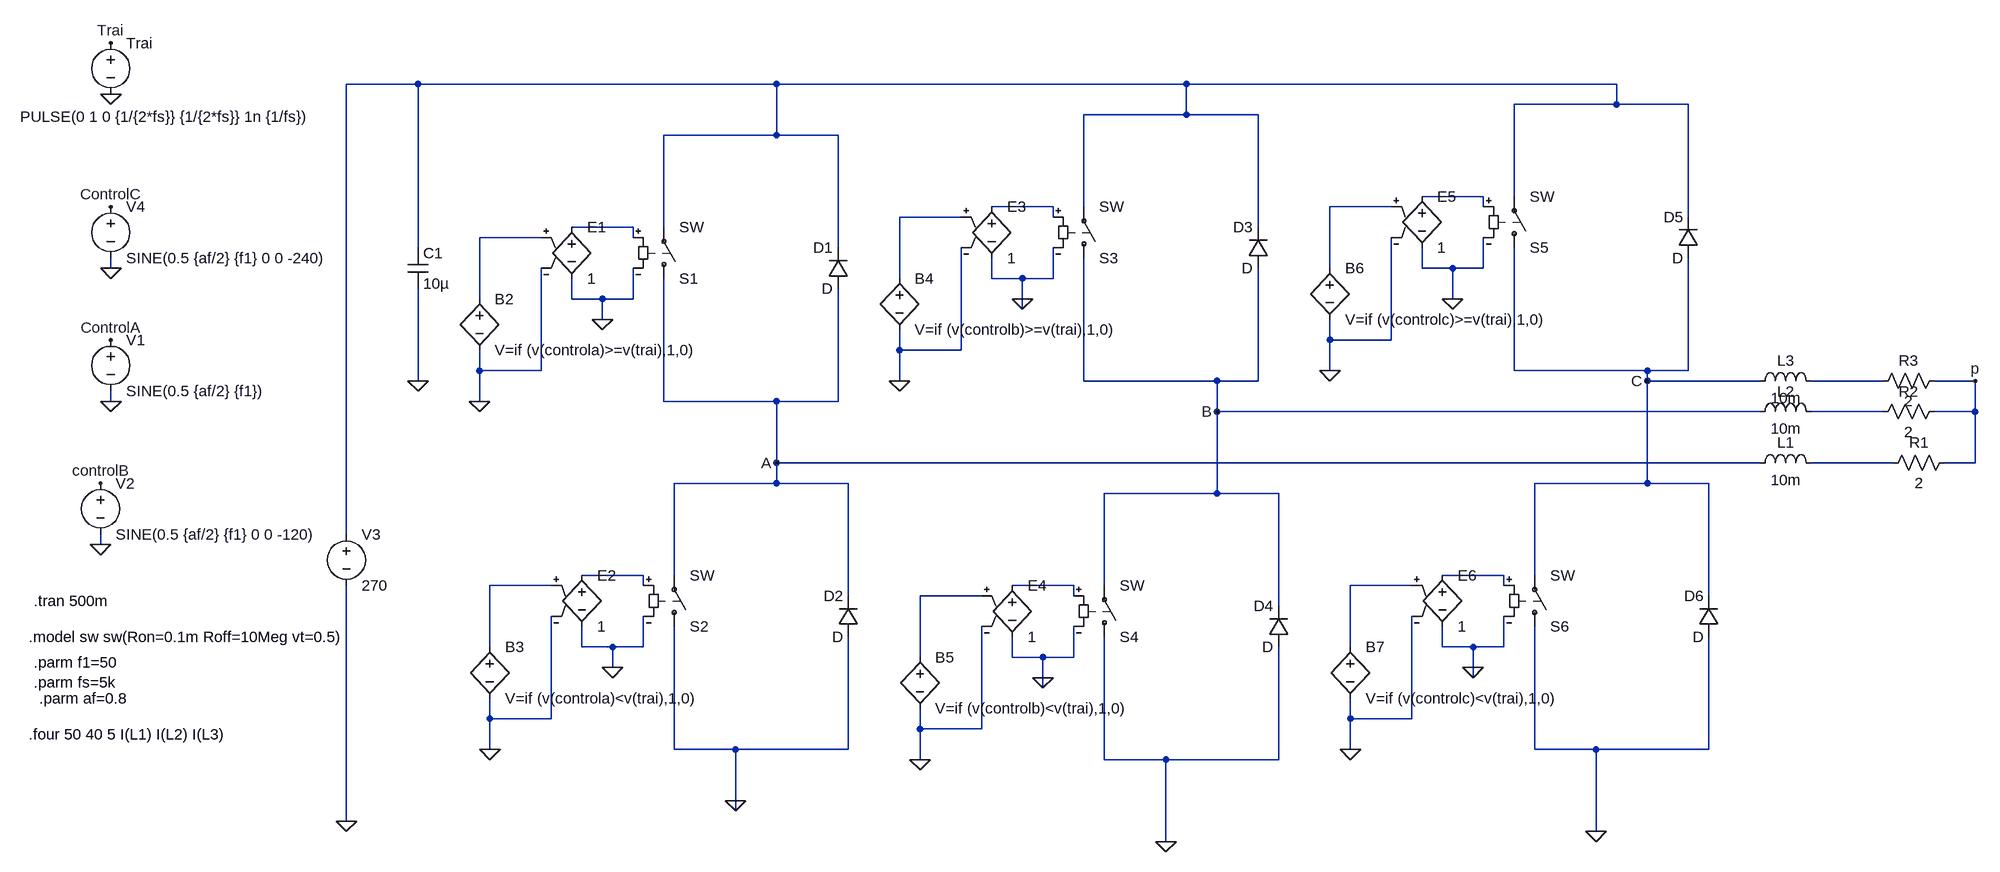
[diagram p0: schematic 3-PHASE INVERTER.asc]
3-PHASE INVERTER.asc, the LTspice schematic file:
Version 4
SHEET 1 4212 1888
WIRE 672 16 560 16
WIRE 1232 16 672 16
WIRE 1872 16 1232 16
WIRE 2544 16 1872 16
WIRE 2544 48 2544 16
WIRE 2544 48 2384 48
WIRE 2656 48 2544 48
WIRE 1872 64 1872 16
WIRE 1872 64 1712 64
WIRE 1984 64 1872 64
WIRE 1232 96 1232 16
WIRE 1232 96 1056 96
WIRE 1328 96 1232 96
WIRE 2336 192 2240 192
WIRE 2384 192 2384 48
WIRE 1664 208 1568 208
WIRE 1712 208 1712 64
WIRE 2192 208 2096 208
WIRE 2336 208 2336 192
WIRE 1520 224 1424 224
WIRE 1664 224 1664 208
WIRE 2656 224 2656 48
WIRE 1008 240 912 240
WIRE 1056 240 1056 96
WIRE 1984 240 1984 64
WIRE 864 256 768 256
WIRE 1008 256 1008 240
WIRE 672 272 672 16
WIRE 1328 272 1328 96
WIRE 192 304 192 288
WIRE 2096 304 2096 208
WIRE 2240 304 2240 272
WIRE 2288 304 2240 304
WIRE 2336 304 2336 256
WIRE 2336 304 2288 304
WIRE 1424 320 1424 224
WIRE 1568 320 1568 288
WIRE 1616 320 1568 320
WIRE 1664 320 1664 272
WIRE 1664 320 1616 320
WIRE 768 352 768 256
WIRE 912 352 912 320
WIRE 960 352 912 352
WIRE 1008 352 1008 304
WIRE 1008 352 960 352
WIRE 1616 352 1616 320
WIRE 2288 352 2288 304
WIRE 1616 368 1616 352
WIRE 960 384 960 352
WIRE 2096 416 2096 384
WIRE 2192 416 2192 256
WIRE 2192 416 2096 416
WIRE 1424 432 1424 400
WIRE 1520 432 1520 272
WIRE 1520 432 1424 432
WIRE 768 464 768 432
WIRE 864 464 864 304
WIRE 864 464 768 464
WIRE 2096 464 2096 416
WIRE 2384 464 2384 272
WIRE 2592 464 2384 464
WIRE 2656 464 2656 288
WIRE 2656 464 2592 464
WIRE 672 480 672 336
WIRE 1424 480 1424 432
WIRE 1712 480 1712 288
WIRE 1920 480 1712 480
WIRE 1984 480 1984 304
WIRE 1984 480 1920 480
WIRE 2592 480 2592 464
WIRE 2768 480 2592 480
WIRE 2960 480 2848 480
WIRE 3104 480 3040 480
WIRE 192 512 192 496
WIRE 768 512 768 464
WIRE 1056 512 1056 320
WIRE 1232 512 1056 512
WIRE 1328 512 1328 336
WIRE 1328 512 1232 512
WIRE 1920 528 1920 480
WIRE 2768 528 1920 528
WIRE 2960 528 2848 528
WIRE 3104 528 3104 480
WIRE 3104 528 3040 528
WIRE 1232 608 1232 512
WIRE 2768 608 1232 608
WIRE 2976 608 2848 608
WIRE 3104 608 3104 528
WIRE 3104 608 3056 608
WIRE 1232 640 1232 608
WIRE 1232 640 1072 640
WIRE 1344 640 1232 640
WIRE 2592 640 2592 480
WIRE 2592 640 2416 640
WIRE 2688 640 2592 640
WIRE 1920 656 1920 528
WIRE 1920 656 1744 656
WIRE 2016 656 1920 656
WIRE 560 720 560 16
WIRE 176 736 176 720
WIRE 1024 784 928 784
WIRE 1072 784 1072 640
WIRE 2368 784 2272 784
WIRE 2416 784 2416 640
WIRE 880 800 784 800
WIRE 1024 800 1024 784
WIRE 1696 800 1600 800
WIRE 1744 800 1744 656
WIRE 2224 800 2128 800
WIRE 2368 800 2368 784
WIRE 1344 816 1344 640
WIRE 1552 816 1456 816
WIRE 1696 816 1696 800
WIRE 2688 816 2688 640
WIRE 2016 832 2016 656
WIRE 784 896 784 800
WIRE 928 896 928 864
WIRE 976 896 928 896
WIRE 1024 896 1024 848
WIRE 1024 896 976 896
WIRE 2128 896 2128 800
WIRE 2272 896 2272 864
WIRE 2320 896 2272 896
WIRE 2368 896 2368 848
WIRE 2368 896 2320 896
WIRE 1456 912 1456 816
WIRE 1600 912 1600 880
WIRE 1648 912 1600 912
WIRE 1696 912 1696 864
WIRE 1696 912 1648 912
WIRE 976 928 976 896
WIRE 2320 928 2320 896
WIRE 1648 944 1648 912
WIRE 2320 944 2320 928
WIRE 1648 960 1648 944
WIRE 784 1008 784 976
WIRE 880 1008 880 848
WIRE 880 1008 784 1008
WIRE 2128 1008 2128 976
WIRE 2224 1008 2224 848
WIRE 2224 1008 2128 1008
WIRE 1456 1024 1456 992
WIRE 1552 1024 1552 864
WIRE 1552 1024 1456 1024
WIRE 784 1056 784 1008
WIRE 1072 1056 1072 864
WIRE 1168 1056 1072 1056
WIRE 1344 1056 1344 880
WIRE 1344 1056 1168 1056
WIRE 2128 1056 2128 1008
WIRE 2416 1056 2416 864
WIRE 2512 1056 2416 1056
WIRE 2688 1056 2688 880
WIRE 2688 1056 2512 1056
WIRE 1456 1072 1456 1024
WIRE 1744 1072 1744 880
WIRE 1840 1072 1744 1072
WIRE 2016 1072 2016 896
WIRE 2016 1072 1840 1072
WIRE 1168 1136 1168 1056
WIRE 1168 1152 1168 1136
WIRE 560 1168 560 800
WIRE 2512 1184 2512 1056
WIRE 1840 1200 1840 1072
FLAG 192 32 0
FLAG 192 -48 Trai
FLAG 192 512 0
FLAG 192 416 ControlA
FLAG 768 512 0
FLAG 784 1056 0
FLAG 1424 480 0
FLAG 1456 1072 0
FLAG 1168 1136 0
FLAG 1840 1200 0
FLAG 560 1168 0
FLAG 672 480 0
FLAG 2096 464 0
FLAG 2128 1056 0
FLAG 2512 1184 0
FLAG 176 736 0
FLAG 176 640 controlB
FLAG 192 304 0
FLAG 192 208 ControlC
FLAG 3104 480 p
FLAG 1232 608 A
FLAG 1920 528 B
FLAG 2592 480 C
FLAG 960 384 0
FLAG 1616 352 0
FLAG 2288 352 0
FLAG 2320 928 0
FLAG 1648 944 0
FLAG 976 928 0
SYMBOL voltage 192 -64 R0
WINDOW 3 306 131 Right 2
SYMATTR Value PULSE(0 1 0 {1/{2*fs}} {1/{2*fs}} 1n {1/fs})
SYMATTR InstName Trai
SYMBOL voltage 192 400 R0
SYMATTR InstName V1
SYMATTR Value SINE(0.5 {af/2} {f1})
SYMBOL bv 768 336 R0
SYMATTR InstName B2
SYMATTR Value V=if (v(controla)>=v(trai),1,0)
SYMBOL e 912 224 R0
SYMATTR InstName E1
SYMATTR Value 1
SYMBOL sw 1056 336 M180
SYMATTR InstName S1
SYMBOL diode 1344 336 R180
WINDOW 0 24 64 Left 2
WINDOW 3 24 0 Left 2
SYMATTR InstName D1
SYMBOL bv 784 880 R0
SYMATTR InstName B3
SYMATTR Value V=if (v(controla)<v(trai),1,0)
SYMBOL e 928 768 R0
SYMATTR InstName E2
SYMATTR Value 1
SYMBOL sw 1072 880 M180
SYMATTR InstName S2
SYMBOL diode 1360 880 R180
WINDOW 0 24 64 Left 2
WINDOW 3 24 0 Left 2
SYMATTR InstName D2
SYMBOL bv 1424 304 R0
SYMATTR InstName B4
SYMATTR Value V=if (v(controlb)>=v(trai),1,0)
SYMBOL e 1568 192 R0
SYMATTR InstName E3
SYMATTR Value 1
SYMBOL sw 1712 304 M180
SYMATTR InstName S3
SYMBOL diode 2000 304 R180
WINDOW 0 24 64 Left 2
WINDOW 3 24 0 Left 2
SYMATTR InstName D3
SYMBOL bv 1456 896 R0
SYMATTR InstName B5
SYMATTR Value V=if (v(controlb)<v(trai),1,0)
SYMBOL e 1600 784 R0
SYMATTR InstName E4
SYMATTR Value 1
SYMBOL sw 1744 896 M180
SYMATTR InstName S4
SYMBOL diode 2032 896 R180
WINDOW 0 24 64 Left 2
WINDOW 3 24 0 Left 2
SYMATTR InstName D4
SYMBOL voltage 560 704 R0
SYMATTR InstName V3
SYMATTR Value 270
SYMBOL cap 656 272 R0
SYMATTR InstName C1
SYMATTR Value 10µ
SYMBOL bv 2096 288 R0
SYMATTR InstName B6
SYMATTR Value V=if (v(controlc)>=v(trai),1,0)
SYMBOL e 2240 176 R0
SYMATTR InstName E5
SYMATTR Value 1
SYMBOL sw 2384 288 M180
SYMATTR InstName S5
SYMBOL diode 2672 288 R180
WINDOW 0 24 64 Left 2
WINDOW 3 24 0 Left 2
SYMATTR InstName D5
SYMBOL bv 2128 880 R0
SYMATTR InstName B7
SYMATTR Value V=if (v(controlc)<v(trai),1,0)
SYMBOL e 2272 768 R0
SYMATTR InstName E6
SYMATTR Value 1
SYMBOL sw 2416 880 M180
SYMATTR InstName S6
SYMBOL diode 2704 880 R180
WINDOW 0 24 64 Left 2
WINDOW 3 24 0 Left 2
SYMATTR InstName D6
SYMBOL voltage 176 624 R0
SYMATTR InstName V2
SYMATTR Value SINE(0.5 {af/2} {f1} 0 0 -120)
SYMBOL voltage 192 192 R0
SYMATTR InstName V4
SYMATTR Value SINE(0.5 {af/2} {f1} 0 0 -240)
SYMBOL ind 2752 624 R270
WINDOW 0 32 56 VTop 2
WINDOW 3 5 56 VBottom 2
SYMATTR InstName L1
SYMATTR Value 10m
SYMBOL res 2960 624 R270
WINDOW 0 32 56 VTop 2
WINDOW 3 0 56 VBottom 2
SYMATTR InstName R1
SYMATTR Value 2
SYMBOL res 2944 544 R270
WINDOW 0 32 56 VTop 2
WINDOW 3 0 56 VBottom 2
SYMATTR InstName R2
SYMATTR Value 2
SYMBOL ind 2752 544 R270
WINDOW 0 32 56 VTop 2
WINDOW 3 5 56 VBottom 2
SYMATTR InstName L2
SYMATTR Value 10m
SYMBOL ind 2752 496 R270
WINDOW 0 32 56 VTop 2
WINDOW 3 5 56 VBottom 2
SYMATTR InstName L3
SYMATTR Value 10m
SYMBOL res 2944 496 R270
WINDOW 0 32 56 VTop 2
WINDOW 3 0 56 VBottom 2
SYMATTR InstName R3
SYMATTR Value 2
TEXT 72 920 Left 2 !.parm f1=50\n.parm fs=5k
TEXT 80 976 Left 2 !.parm af=0.8
TEXT 72 824 Left 2 !.tran 500m
TEXT 64 880 Left 2 !.model sw sw(Ron=0.1m Roff=10Meg vt=0.5)
TEXT 64 1032 Left 2 !.four 50 40 5 I(L1) I(L2) I(L3)

The netlist it stands for:
* 3-PHASE INVERTER.asc
V§Trai Trai 0 PULSE(0 1 0 {1/{2*fs}} {1/{2*fs}} 1n {1/fs})
V1 ControlA 0 SINE(0.5 {af/2} {f1})
B2 N007 0 V=if (v(controla)>=v(trai),1,0)
E1 N006 0 N007 0 1
S1 A N001 N006 0 SW
D1 A N001 D
B3 N013 0 V=if (v(controla)<v(trai),1,0)
E2 N011 0 N013 0 1
S2 0 A N011 0 SW
D2 0 A D
B4 N005 0 V=if (v(controlb)>=v(trai),1,0)
E3 N003 0 N005 0 1
S3 B N001 N003 0 SW
D3 B N001 D
B5 N016 0 V=if (v(controlb)<v(trai),1,0)
E4 N014 0 N016 0 1
S4 0 B N014 0 SW
D4 0 B D
V3 N001 0 270
C1 N001 0 10µ
B6 N004 0 V=if (v(controlc)>=v(trai),1,0)
E5 N002 0 N004 0 1
S5 C N001 N002 0 SW
D5 C N001 D
B7 N015 0 V=if (v(controlc)<v(trai),1,0)
E6 N012 0 N015 0 1
S6 0 C N012 0 SW
D6 0 C D
V2 controlB 0 SINE(0.5 {af/2} {f1} 0 0 -120)
V4 ControlC 0 SINE(0.5 {af/2} {f1} 0 0 -240)
L1 A N010 10m
R1 N010 p 2
R2 N009 p 2
L2 B N009 10m
L3 C N008 10m
R3 N008 p 2
.model D D
.lib standard.dio
.parm f1=50
.parm fs=5k
.parm af=0.8
.tran 500m
.model sw sw(Ron=0.1m Roff=10Meg vt=0.5)
.four 50 40 5 I(L1) I(L2) I(L3)
.backanno
.end